# EAGLE design src_md (EAGLE 7.3.0)
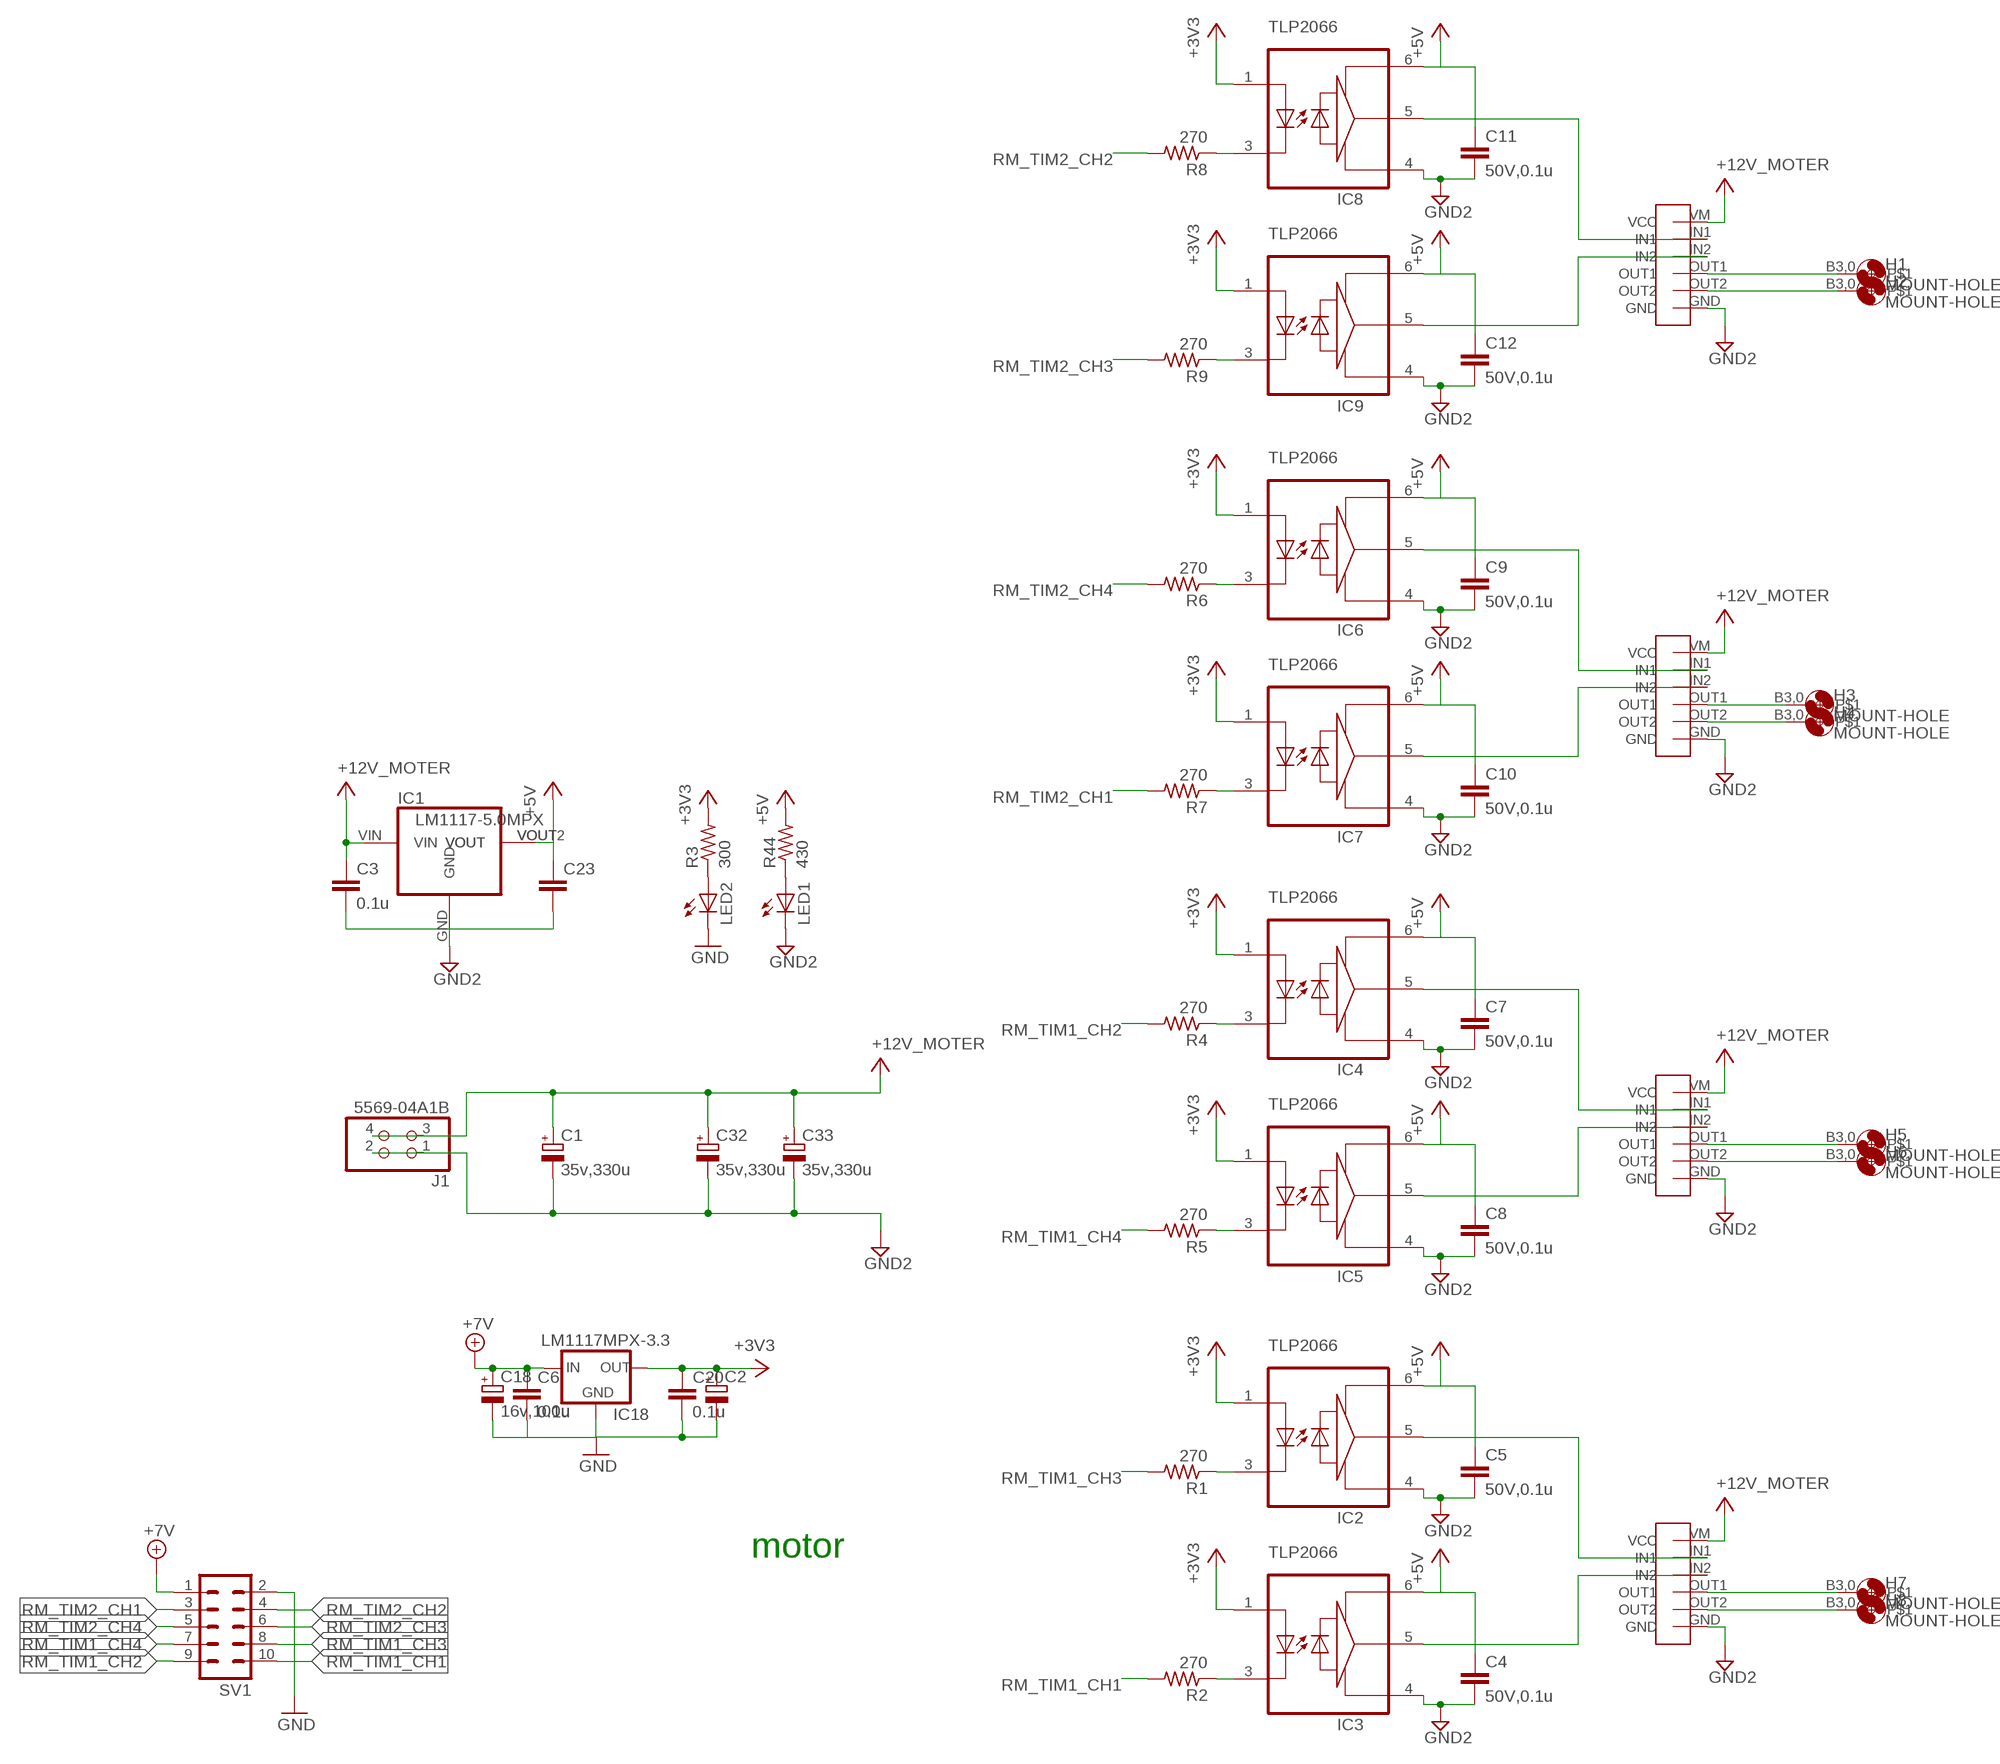
[diagram p0: schematic, sheet 1]

## Parts
C1  35v,330u  CPOL-EU153CLV-1010  [153CLV-1010]
C2  CPOL-EU153CLV-0505  [153CLV-0505]
C3  0.1u  C-EUC0603K  [C0603K]
C4  50V,0.1u  C-EUC0603  [C0603]
C5  50V,0.1u  C-EUC0603  [C0603]
C6  0.1u  C-EUC0603  [C0603]
C7  50V,0.1u  C-EUC0603  [C0603]
C8  50V,0.1u  C-EUC0603  [C0603]
C9  50V,0.1u  C-EUC0603  [C0603]
C10  50V,0.1u  C-EUC0603  [C0603]
C11  50V,0.1u  C-EUC0603  [C0603]
C12  50V,0.1u  C-EUC0603  [C0603]
C18  16v,100u  CPOL-EU153CLV-0605  [153CLV-0605]
C20  0.1u  C-EUC0603K  [C0603K]
C23  C-EUC0603K  [C0603K]
C32  35v,330u  CPOL-EU153CLV-1010  [153CLV-1010]
C33  35v,330u  CPOL-EU153CLV-1010  [153CLV-1010]
H1  MOUNT-HOLE  [3,0-PAD]
H2  MOUNT-HOLE  [3,0-PAD]
H3  MOUNT-HOLE  [3,0-PAD]
H4  MOUNT-HOLE  [3,0-PAD]
H5  MOUNT-HOLE  [3,0-PAD]
H6  MOUNT-HOLE  [3,0-PAD]
H7  MOUNT-HOLE  [3,0-PAD]
H8  MOUNT-HOLE  [3,0-PAD]
IC1  LM1117-5.0MPX  LM1117-5.0IMP  [SOT223]
IC2  TLP2066  TLP117  [MFSOP6]
IC3  TLP2066  TLP117  [MFSOP6]
IC4  TLP2066  TLP117  [MFSOP6]
IC5  TLP2066  TLP117  [MFSOP6]
IC6  TLP2066  TLP117  [MFSOP6]
IC7  TLP2066  TLP117  [MFSOP6]
IC8  TLP2066  TLP117  [MFSOP6]
IC9  TLP2066  TLP117  [MFSOP6]
IC18  LM1117MPX-3.3  LM1117  [SOT223]
J1  5569-04A1B  [5569-04A1_2]
LED1  LEDCHIPLED_1206  [CHIPLED_1206]
LED2  LEDCHIPLED_1206  [CHIPLED_1206]
R1  270  R-US_R0603  [R0603]
R2  270  R-US_R0603  [R0603]
R3  300  R-US_M2012  [M2012]
R4  270  R-US_R0603  [R0603]
R5  270  R-US_R0603  [R0603]
R6  270  R-US_R0603  [R0603]
R7  270  R-US_R0603  [R0603]
R8  270  R-US_R0603  [R0603]
R9  270  R-US_R0603  [R0603]
R44  430  R-US_M2012  [M2012]
SV1  ML10L10PIN_T  [ML10L]
U$1  TB6643  [TB6643]
U$2  TB6643  [TB6643]
U$3  TB6643  [TB6643]
U$4  TB6643  [TB6643]

## Nets
+3V3: C2.+ C20.1 IC2.1 IC3.1 IC4.1 IC5.1 IC6.1 IC7.1 IC8.1 IC9.1 IC18.2(OUT1) IC18.4(OUT) R3.2
+5V [VCC]: C4.1 C5.1 C7.1 C8.1 C9.1 C10.1 C11.1 C12.1 C23.1 IC1.VOUT IC1.VOUT2(VOUT) IC2.6(VCC) IC3.6(VCC) IC4.6(VCC) IC5.6(VCC) IC6.6(VCC) IC7.6(VCC) IC8.6(VCC) IC9.6(VCC) R44.2
+7V [VCC]: C6.1 C18.+ IC18.3(IN) SV1.1
GND [GND]: C2.- C6.2 C18.- C20.2 IC18.1(GND) LED2.C SV1.2
GND2: C1.- C3.2 C4.2 C5.2 C7.2 C8.2 C9.2 C10.2 C11.2 C12.2 C23.2 C32.- C33.- IC1.GND IC2.4(GND) IC3.4(GND) IC4.4(GND) IC5.4(GND) IC6.4(GND) IC7.4(GND) IC8.4(GND) IC9.4(GND) J1.1 J1.2 LED1.C U$1.GND U$2.GND U$3.GND U$4.GND
N$1: IC2.3 R1.1
N$2: IC3.3 R2.1
N$3: IC2.5 U$1.IN1
N$4: IC3.5 U$1.IN2
N$6: LED2.A R3.1
N$7: IC4.3 R4.1
N$8: IC5.3 R5.1
N$9: IC4.5 U$2.IN1
N$10: IC5.5 U$2.IN2
N$11: H5.B3,0 U$2.OUT1
N$12: H6.B3,0 U$2.OUT2
N$13: IC6.3 R6.1
N$14: IC7.3 R7.1
N$15: H7.B3,0 U$1.OUT1
N$16: IC6.5 U$3.IN1
N$17: H8.B3,0 U$1.OUT2
N$18: IC7.5 U$3.IN2
N$19: H3.B3,0 U$3.OUT1
N$20: H4.B3,0 U$3.OUT2
N$21: IC8.3 R8.1
N$22: IC9.3 R9.1
N$23: IC8.5 U$4.IN1
N$24: IC9.5 U$4.IN2
N$25: H1.B3,0 U$4.OUT1
N$26: H2.B3,0 U$4.OUT2
N$28: LED1.A R44.1
RM_TIM1_CH1: R2.2 SV1.10
RM_TIM1_CH2: R4.2 SV1.9
RM_TIM1_CH3: R1.2 SV1.8
RM_TIM1_CH4: R5.2 SV1.7
RM_TIM2_CH1: R7.2 SV1.3
RM_TIM2_CH2: R8.2 SV1.4
RM_TIM2_CH3: R9.2 SV1.6
RM_TIM2_CH4: R6.2 SV1.5
V+: C1.+ C3.1 C32.+ C33.+ IC1.VIN J1.3 J1.4 U$1.VM(VCC) U$2.VM(VCC) U$3.VM(VCC) U$4.VM(VCC) ; supply symbol labelled +12V_MOTER

## Notes on the sheet
- TLP2066
- TLP2066
- TLP2066
- TLP2066
- TLP2066
- TLP2066
- TLP2066
- motor | TLP2066

## Library data of the parts
C1 C2 C18 C32 C33 = rcl:CPOL-EU: POLARIZED CAPACITOR, European symbol
C3 C20 C23 = resistor:C-EU: CAPACITOR, European symbol
C4-C12 = rcl:C-EU: CAPACITOR, European symbol
H1-H8 = holes:MOUNT-HOLE: MOUNTING HOLE with drill center marker
IC1 = Regulator:LM1117: 800mA and 1A Low Dropout (LDO) Positive Regulator 1.8V, 2.5V, 2.85V, 3.3V, 5V, and Adj
IC2-IC9 = PhotoCoupler:TLP117
IC18 = VoltageRegulator:LM1117
J1 = Molex:5569-04A1
LED1 LED2 = led:LED: LED OSRAM: - CHIPLED LG R971, LG N971, LY N971, LG Q971, LY Q971, LO R971, LY R971 LH N974, LH R974 LS Q976, LO Q976, LY Q976 LO Q996 - Hyper CHIPLED LW Q18S LB Q993, LB Q99A, LB R99A - SideLED LS A670, LO A670, LY A670, LG A670, LP A670 LB A673, LV A673, LT A673, LW A673 LH A674 LY A675 LS A676, LA A676, LO A676, LY A676, LW A676 LS A679, LY A679, LG A679 - Hyper Micro SIDELED® LS Y876, LA Y876, LO Y876, LY Y876 LT Y87S - SmartLED LW L88C, LW L88S LB L89C, LB L89S, LG L890 LS L89K, LO L89K, LY L89K LS L896, LA L896, LO L896, LY L896 - TOPLED LS T670, LO T670, LY T670, LG T670, LP T670 LSG T670, LSP T670, LSY T670, LOP T670, LYG T670 LG T671, LOG T671, LSG T671 LB T673, LV T673, LT T673, LW T673 LH T674 LS T676, LA T676, LO T676, LY T676, LB T676, LH T676, LSB T676, LW T676 LB T67C, LV T67C, LT T67C, LS T67K, LO T67K, LY T67K, LW E67C LS E67B, LA E67B, LO E67B, LY E67B, LB E67C, LV E67C, LT E67C LW T67C LS T679, LY T679, LG T679 LS T770, LO T770, LY T770, LG T770, LP T770 LB T773, LV T773, LT T773, LW T773 LH T774 LS E675, LA E675, LY E675, LS T675 LS T776, LA T776, LO T776, LY T776, LB T776 LHGB T686 LT T68C, LB T68C - Hyper Mini TOPLED® LB M676 - Mini TOPLED Santana® LG M470 LS M47K, LO M47K, LY M47K Source: http://www.osram.convergy.de LUXEON: - LUMILED® LXK2-PW12-R00, LXK2-PW12-S00, LXK2-PW14-U00, LXK2-PW14-V00 LXK2-PM12-R00, LXK2-PM12-S00, LXK2-PM14-U00 LXK2-PE12-Q00, LXK2-PE12-R00, LXK2-PE12-S00, LXK2-PE14-T00, LXK2-PE14-U00 LXK2-PB12-K00, LXK2-PB12-L00, LXK2-PB12-M00, LXK2-PB14-N00, LXK2-PB14-P00, LXK2-PB14-Q00 LXK2-PR12-L00, LXK2-PR12-M00, LXK2-PR14-Q00, LXK2-PR14-R00 LXK2-PD12-Q00, LXK2-PD12-R00, LXK2-PD12-S00 LXK2-PH12-R00, LXK2-PH12-S00 LXK2-PL12-P00, LXK2-PL12-Q00, LXK2-PL12-R00 Source: www.luxeon.com KINGBRIGHT: KA-3528ASYC Source: www.kingbright.com
R1 R2 R4-R9 = resistor:R-US_: RESISTOR, American symbol
R3 R44 = rcl:R-US_: RESISTOR, American symbol
SV1 = con-ml:ML10L: HARTING
U$1-U$4 = tb6643:TB6643

## Board
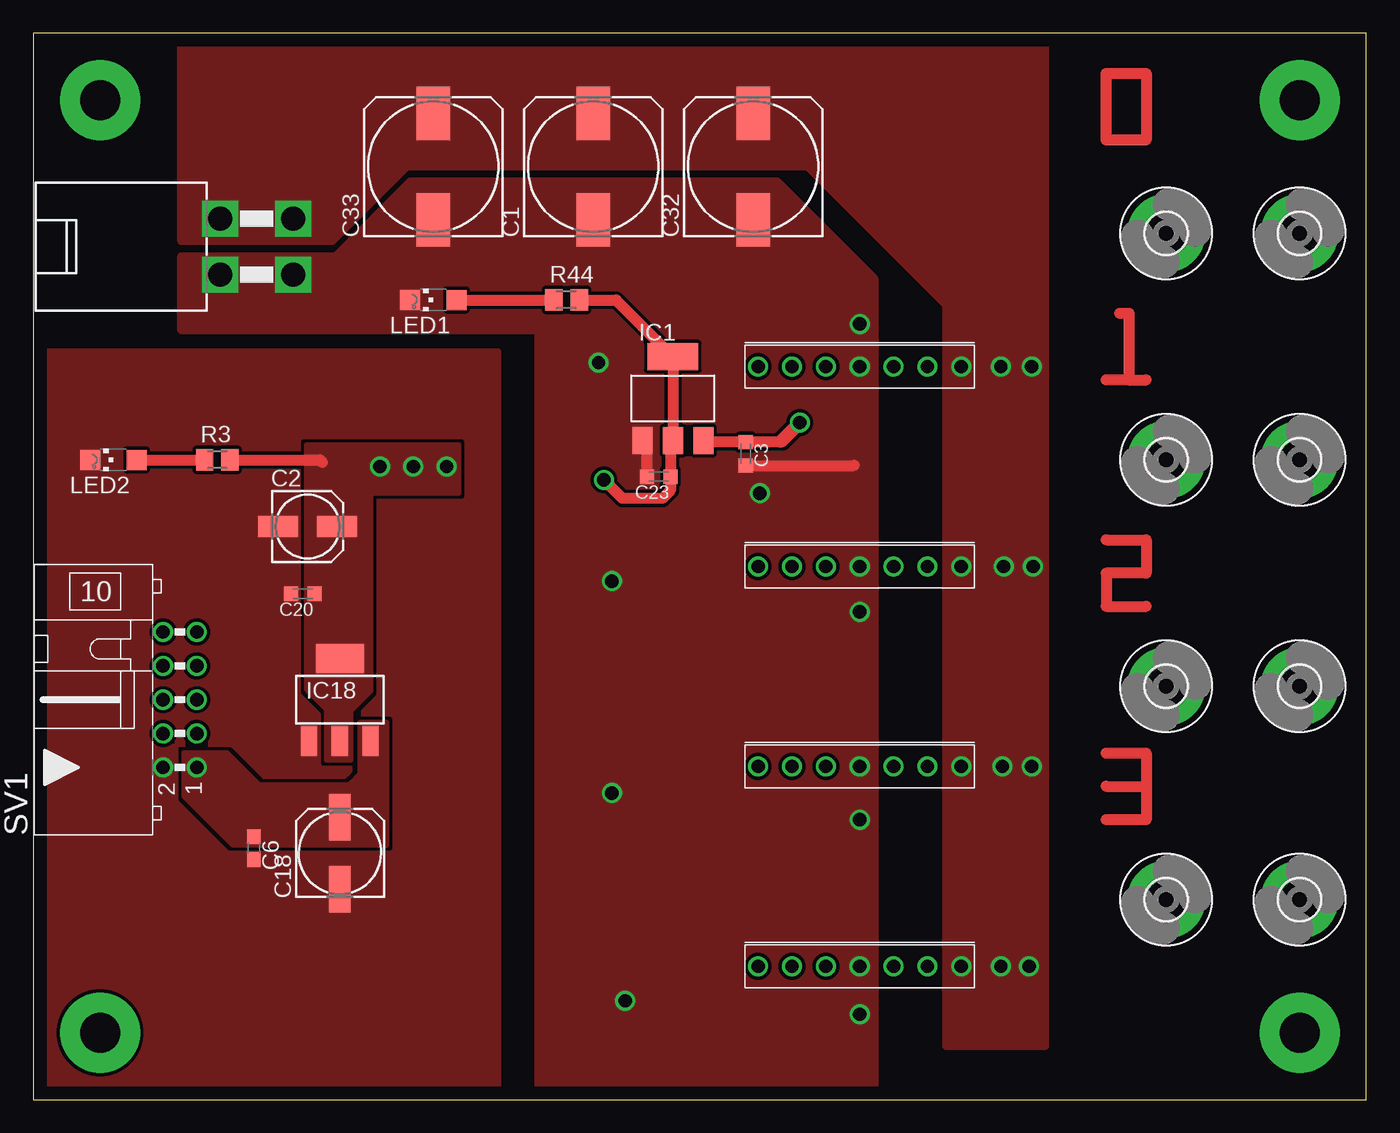
[diagram p1: board, top side]
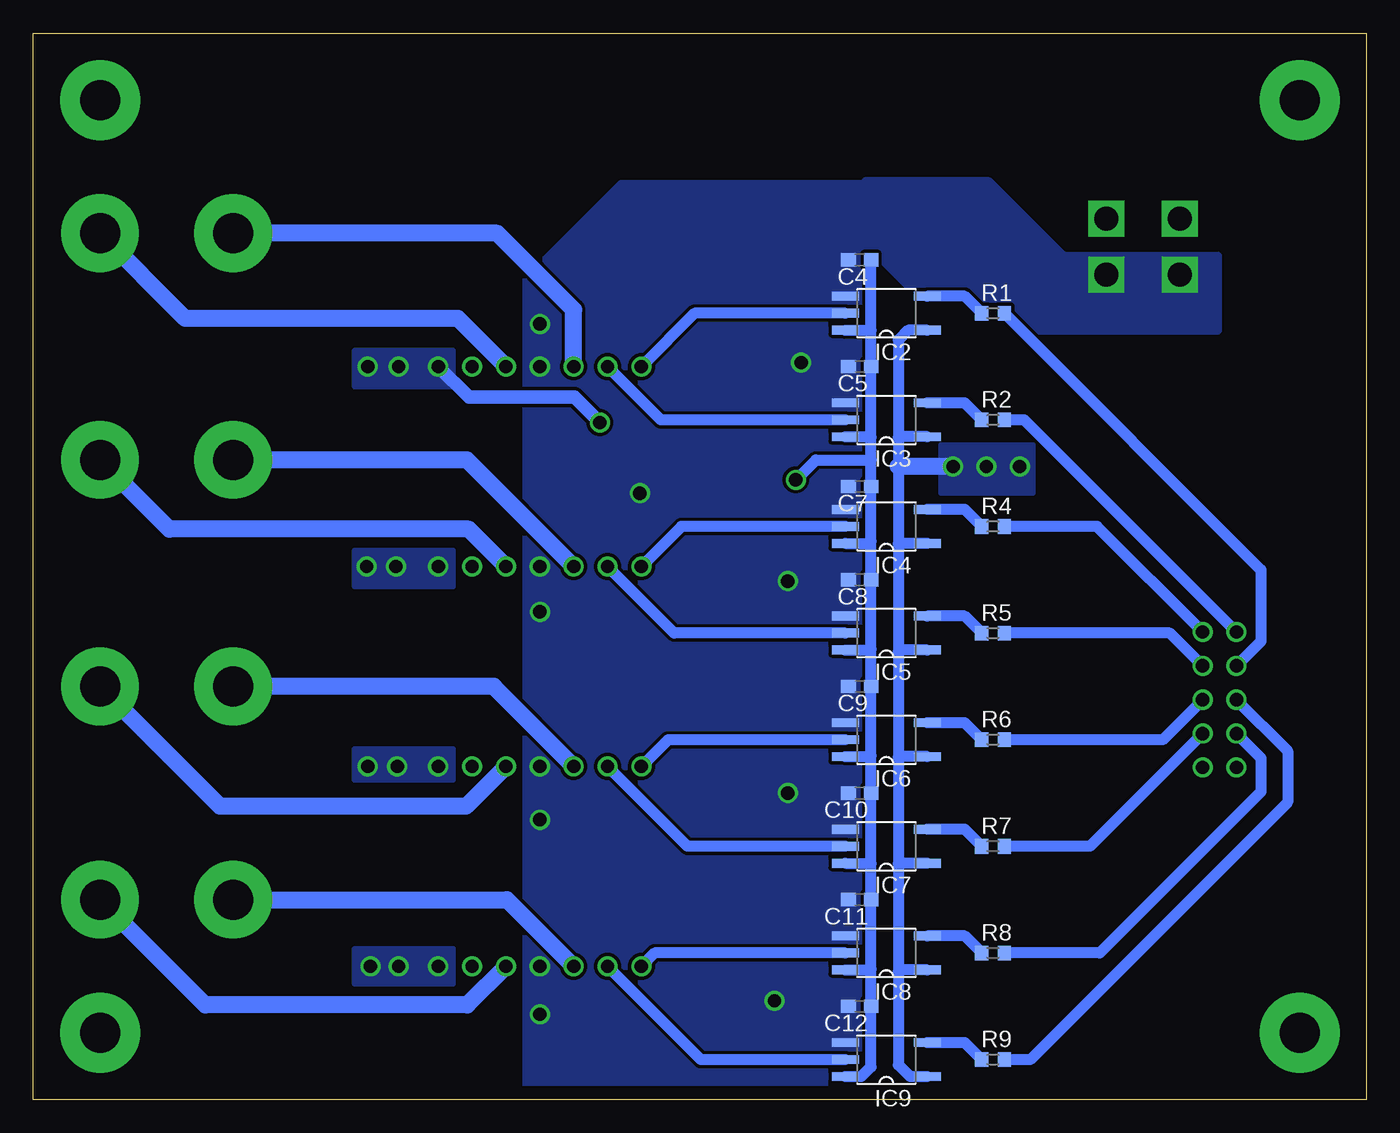
[diagram p2: board, bottom side, seen from below]

Size 100 x 80 mm. Coordinates in mm from the lower left corner, seen from the top.
Outline: 0,0 100,0 100,80 0,80 0,0
Copper layers (1*16): Top 0.035mm / dielectric 1.5mm / Bottom 0.035mm
Design rules "default *": minimum track width 16mil, minimum drill 24mil, track to track 10mil, track to pad 10mil, pad to pad 10mil, via to via 10mil, smd to smd 10mil, copper to edge 40mil, drill to drill 8mil, minimum pad ring 10mil, minimum via ring 8mil, stop-mask expansion 4mil, vias tented up to drill 0mil, thermal gap 10mil

### Footprints (pad centres in the part's own frame; a part is rotated, then mirrored left to right if it is on the bottom)
153CLV-1010 = smd 4 x 2.5: + 4,0; - -4,0
153CLV-0505 = smd 3 x 1.6: + 2.2,0; - -2.2,0
C0603K = smd 1.05 x 1.08: 1 -0.875,0; 2 0.875,0
C0603 = smd 1.1 x 1: 1 -0.85,0; 2 0.85,0
153CLV-0605 = smd 3.5 x 1.6: + 2.7,0; - -2.7,0
3,0-PAD = drill 3 pad 5.842: B3,0 0,0
SOT223 = smd 1.499 x 2.007: GND -2.261,-3.15; VIN 2.311,-3.15; VOUT 0.025,-3.15 | smd 3.81 x 2.007: VOUT2 0,3.15
MFSOP6 = smd 0.66 x 2.032: 1 -1.27,-3.073; 3 1.27,-3.073; 4 1.27,3.073; 5 0,3.073; 6 -1.27,3.073
SOT223' = smd 1.219 x 2.235: 1 -2.311,-3.099; 2 0,-3.099; 3 2.311,-3.099 | smd 3.6 x 2.2: 4 0,3.099
5569-04A1_2 = drill 1.8 square: 1 2.1,0; 2 2.1,5.5; 3 -2.1,0; 4 -2.1,5.5
CHIPLED_1206 = smd 1.5 x 1.5: A 0,-1.75; C 0,1.75
R0603 = smd 1 x 1.1: 1 -0.85,0; 2 0.85,0
M2012 = smd 1.3 x 1.6: 1 -0.95,0; 2 0.95,0
ML10L = drill 1: 1 -5.08,-1.27; 2 -5.08,1.27; 3 -2.54,-1.27; 4 -2.54,1.27; 5 0,-1.27; 6 0,1.27; 7 2.54,-1.27; 8 2.54,1.27; 9 5.08,-1.27; 10 5.08,1.27
TB6643 = drill 1: GND 0,0; IN1 -7.62,0; IN2 -5.08,0; NC 5.08,0; OUT1 -2.54,0; OUT2 2.54,0; VM 7.62,0

### Placement (x,y rotation side)
C1  42,70 90 top
C2  20.58,42.99 0 top
C3  53.45,48.45 270 top
C4  38,63 180 bottom
C5  38,55 180 bottom
C6  16.55,18.87 270 top
C7  38,46 180 bottom
C8  38,39 180 bottom
C9  38,31 180 bottom
C10  38,23 180 bottom
C11  38,15 180 bottom
C12  38,7 180 bottom
C18  23,18.5 90 top
C20  20.23,37.95 180 top
C23  46.92,46.74 180 top
C32  54,70 90 top
C33  30,70 90 top
H1  85,15 0 top
H2  95,15 0 top
H3  85,31 0 top
H4  95,31 0 top
H5  85,48 0 top
H6  95,48 0 top
H7  85,65 0 top
H8  95,65 0 top
IC1  47.97,52.6 0 top
IC2  36,59 90 bottom
IC3  36,51 90 bottom
IC4  36,43 90 bottom
IC5  36,35 90 bottom
IC6  36,27 90 bottom
IC7  36,19 90 bottom
IC8  36,11 90 bottom
IC9  36,3 90 bottom
IC18  LM1117MPX-3.3  [SOT223']  23,30 0 top
J1  14,64 270 top
LED1  30,60 90 top
LED2  6,48 90 top
R1  28,59 0 bottom
R2  28,51 0 bottom
R3  13.8,48 0 top
R4  28,43 0 bottom
R5  28,35 0 bottom
R6  28,27 0 bottom
R7  28,19 0 bottom
R8  28,11 0 bottom
R9  28,3 0 bottom
R44  40,60 0 top
SV1  11,30 90 top
U$1  62,55 0 top
U$2  62,40 0 top
U$3  62,25 0 top
U$4  62,10 0 top

### Tracks (layer width: path | path; a pad name or v marks a point on that pad's centre or on a via)
+3V3  (via drill 1)
  Top 0.813: R3.2 21.5,48 21.7,47.8
  Bottom 0.813: IC2.1 34.37,57.73 35.1,57 35.1,49.7 | 35.1,49.7 35.1,47.5 35.1,41.7 | 35.1,41.7 35.1,33.6 | 35.1,33.6 35.1,25.7 | 35.1,25.7 35.1,17.7 | 35.1,17.7 35.1,9.6 | 35.1,9.6 35.1,2.6 34.23,1.73 IC9.1 | IC3.1 35.07,49.73 35.1,49.7 | IC4.1 35.07,41.73 35.1,41.7 | IC5.1 34.97,33.73 35.1,33.6 | IC6.1 35.07,25.73 35.1,25.7 | IC7.1 35.07,17.73 35.1,17.7 | IC8.1 34.97,9.73 35.1,9.6
  Bottom 1.27: v31,47.5 35.1,47.5
  other vias: 26,47.5 28.5,47.5
  pour Top (no thermals): 20.5,49.1 20.5,30.8 22,29.3 22,25.5 23.8,25.5 23.8,29.2 25.3,30.7 25.3,49.1
  pour Top (no thermals): 23.7,49.1 31.9,49.1 31.9,45.5 23.7,45.5
  pour Bottom (no thermals): 25,49.1 31.9,49.1 31.9,45.5 25,45.5
+5V  (via drill 1)
  Top 0.813: v42.8,46.5 44.2,45.1 47.2,45.1 47.8,45.7 C23.1 47.8,49.25 IC1.VOUT 47.99,55.72 IC1.VOUT2 43.72,60 R44.2
  Bottom 0.813: IC9.6 37.87,1.73 37.15,2.45 C12.1 37.15,9.8 | 37.15,9.8 C11.1 37.15,17.7 | 37.15,17.7 C10.1 37.15,25.8 | 37.15,25.8 C9.1 37.15,33.8 | 37.15,33.8 C8.1 37.15,41.9 | 37.15,41.9 C7.1 37.15,48 | 37.15,48 37.15,49.7 | 37.15,49.7 C5.1 37.15,57.7 | 37.15,57.7 C4.1 | 37.15,48 41.3,48 v42.8,46.5 | IC2.6 37.18,57.73 37.15,57.7 | IC3.6 37.18,49.73 37.15,49.7 | IC4.6 37.32,41.73 37.15,41.9 | IC5.6 37.22,33.73 37.15,33.8 | IC6.6 37.22,25.73 37.15,25.8 | IC7.6 37.18,17.73 37.15,17.7 | IC8.6 37.22,9.73 37.15,9.8
+7V
  pour Top (no thermals): 11.3,26 14.5,26 16.9,23.6 23.7,23.6 24.2,24.1 24.5,24.4 24.5,28.3 26.5,28.3 26.5,19.1 15,19.1 12.8,21.3 11.3,22.8
GND
  pour Top (rank 6, no thermals): -1.5,56.1 34.8,56.1 34.8,-4.3 -1.5,-4.3
GND2  (via drill 1)
  Top 0.813: C23.2 46.05,49.12 IC1.GND | C3.2 61.58,47.58 61.6,47.6
  other vias: 62,6.4 62,21 62,36.6 42.4,55.3 43.4,38.9 43.4,23 44.4,7.4 62,58.2 54.5,45.5
  pour Bottom (rank 6, no thermals): 37,68.8 55.9,68.8 63.1,61.6 63.1,-4.5 37,-4.5
  pour Top (rank 6, no thermals): 11.1,63.3 22.7,63.3 28.3,68.9 55.8,68.9 63.1,61.6 63.1,-4.2 37.9,-4.2 37.9,57.7 11.1,57.7
  pour Bottom (rank 6, no thermals): 11.1,63.3 22.7,63.3 28.3,68.9 37.6,68.9 37.6,64.3 31,57.7 11.1,57.7
N$1
  Bottom 0.813: R1.1 30.12,60.27 IC2.3
N$2
  Bottom 0.813: R2.1 30.12,52.27 IC3.3
N$3
  Bottom 0.813: IC2.5 50.38,59 U$1.IN1
N$4
  Bottom 0.813: IC3.5 52.92,51 U$1.IN2
N$5
  Top 0.813: 80.5,77 83.5,77 83.5,72 80.5,72 80.5,77
N$6
  Top 0.813: LED2.A R3.1
N$7
  Bottom 0.813: R4.1 30.12,44.27 IC4.3
N$8
  Bottom 0.813: R5.1 30.12,36.27 IC5.3
N$9
  Bottom 0.813: IC4.5 51.38,43 U$2.IN1
N$10
  Bottom 0.813: IC5.5 51.92,35 U$2.IN2
N$11
  Bottom 1.27: U$2.OUT1 67.46,48 H5.B3,0
N$12
  Bottom 1.27: U$2.OUT2 67.34,42.8 89.8,42.8 H6.B3,0
N$13
  Bottom 0.813: R6.1 30.12,28.27 IC6.3
N$14
  Bottom 0.813: R7.1 30.12,20.27 IC7.3
N$15
  Bottom 1.27: H7.B3,0 65.2,65 59.46,59.26 U$1.OUT1
N$16
  Bottom 0.813: IC6.5 52.38,27 U$3.IN1
N$17
  Bottom 1.27: U$1.OUT2 68.14,58.6 88.6,58.6 H8.B3,0
N$18
  Bottom 0.813: IC7.5 50.92,19 U$3.IN2
N$19
  Bottom 1.27: U$3.OUT1 65.46,31 H3.B3,0
N$20
  Bottom 1.27: U$3.OUT2 67.54,22 86,22 H4.B3,0
N$21
  Bottom 0.813: R8.1 30.12,12.27 IC8.3
N$22
  Bottom 0.813: R9.1 30.12,4.27 IC9.3
N$23
  Bottom 0.813: IC8.5 53.38,11 U$4.IN1
N$24
  Bottom 0.813: IC9.5 49.92,3 U$4.IN2
N$25
  Bottom 1.27: H1.B3,0 64.46,15 U$4.OUT1
N$26
  Bottom 1.27: U$4.OUT2 67.44,7.1 87.1,7.1 H2.B3,0
N$27
  Top 0.813: 81.5,59 82.2,59 82.2,54 | 82.2,54 80.5,54 | 82.2,54 83.5,54
N$28
  Top 0.813: LED1.A R44.1
N$29
  Top 0.813: 80.5,42 83.5,42 83.5,39.5 80.5,39.5 80.5,37 83.5,37
N$30
  Top 0.813: 80.5,26 83.5,26 83.5,23.5 | 83.5,23.5 83.5,21 80.5,21 | 80.5,23.5 83.5,23.5
N$36  (via drill 3 pad 6)
  other vias: 5,75
N$37  (via drill 3 pad 6)
  other vias: 5,5
N$38  (via drill 3 pad 6)
  other vias: 95,5
N$39  (via drill 3 pad 6)
  other vias: 95,75
RM_TIM1_CH1
  Bottom 0.813: R2.2 25.65,51 SV1.10
RM_TIM1_CH2
  Bottom 0.813: R4.2 20.19,43 SV1.9
RM_TIM1_CH3
  Bottom 0.813: R1.2 7.9,39.75 7.9,34.37 SV1.8
RM_TIM1_CH4
  Bottom 0.813: R5.2 14.73,35 SV1.7
RM_TIM2_CH1
  Bottom 0.813: R7.2 20.73,19 SV1.3
RM_TIM2_CH2
  Bottom 0.813: R8.2 20,11 7.9,23.1 7.9,25.63 SV1.4
RM_TIM2_CH3
  Bottom 0.813: R9.2 25.2,3 5.9,22.3 5.9,26.17 SV1.6
RM_TIM2_CH4
  Bottom 0.813: R6.2 15.27,27 SV1.5
V+  (via drill 1)
  Top 0.813: 56.15,49.45 56.02,49.33 C3.1 50.41,49.33 IC1.VIN
  Top 1.016: 56.15,49.45 v57.5,50.8
  Bottom 1.016: v57.5,50.8 59.4,52.7 67.32,52.7 U$1.VM
  other vias: 72.6,55 74.9,55 75,40 72.8,40 74.9,25 72.7,25 74.7,10 72.6,10
  pour Top (no thermals): 11.1,81.3 75.9,81.3 75.9,4 68.5,4 68.5,59.6 58.1,70 28,70 22.4,64.4 11.1,64.4
  pour Bottom (no thermals): 68.5,56.2 75.9,56.2 75.9,53.5 68.5,53.5
  pour Bottom (no thermals): 68.5,41.2 75.9,41.2 75.9,38.5 68.5,38.5
  pour Bottom (no thermals): 68.5,26.3 75.9,26.3 75.9,24 68.5,24
  pour Bottom (no thermals): 68.5,11.3 75.9,11.3 75.9,8.7 68.5,8.7